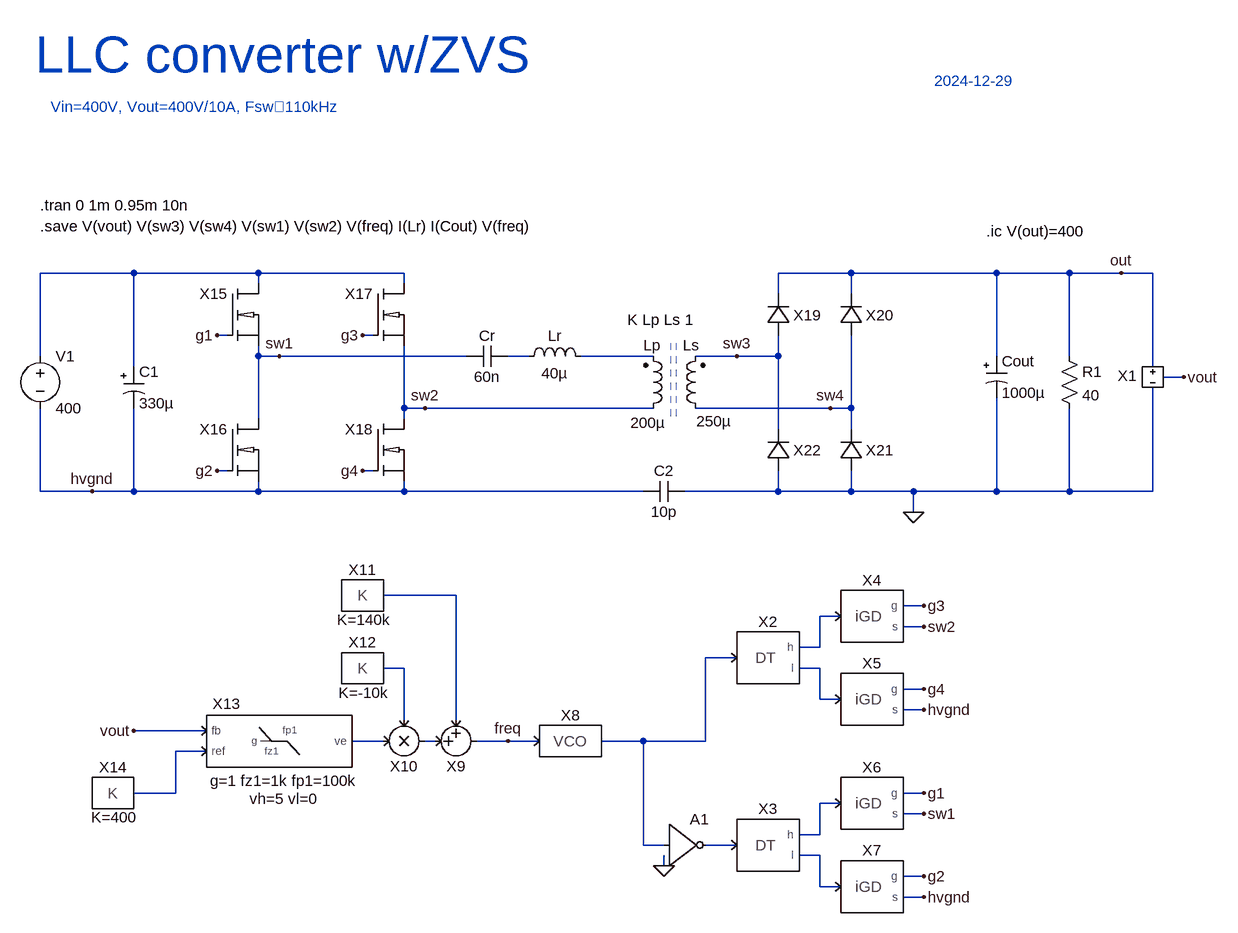
[diagram p0: schematic LLC.asc]
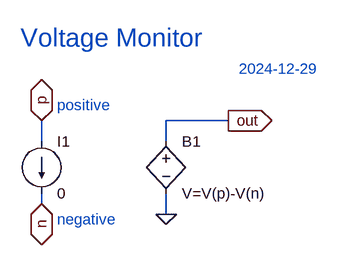
[diagram p1: sub-circuit vmon.asc]
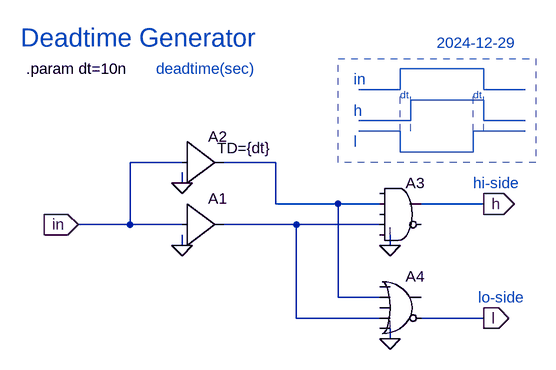
[diagram p2: sub-circuit deadtime.asc]
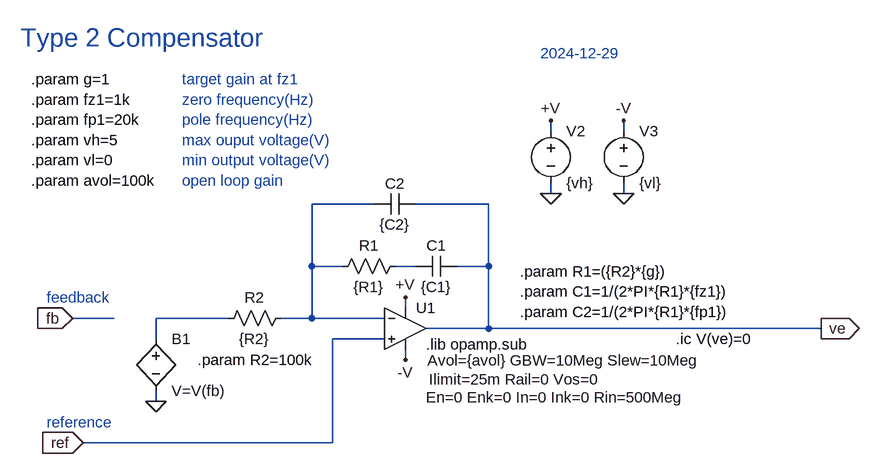
[diagram p3: sub-circuit type2.asc]
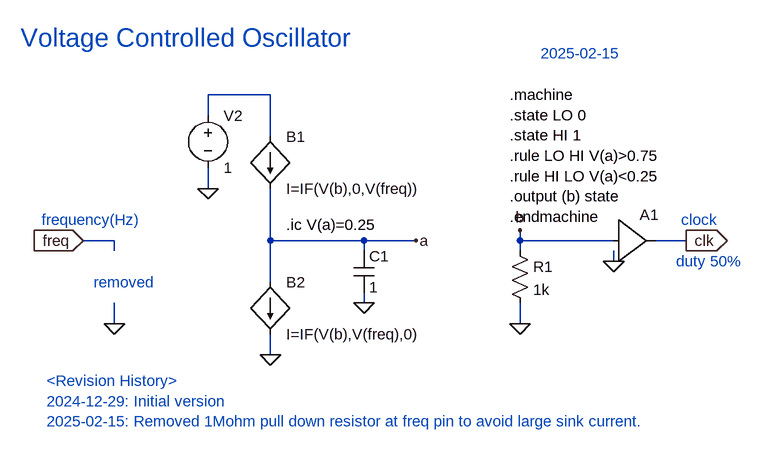
[diagram p4: sub-circuit vco.asc]
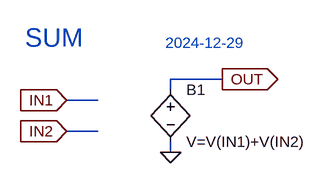
[diagram p5: sub-circuit sum.asc]
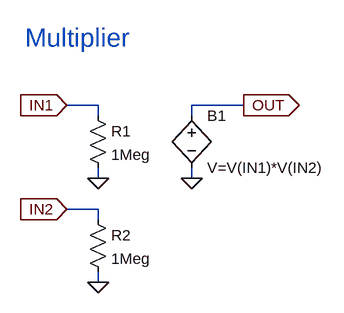
[diagram p6: sub-circuit mul.asc]
LLC.asc, the LTspice schematic file:
Version 4
SHEET 1 1968 1068
WIRE -80 -16 -224 -16
WIRE 112 -16 -80 -16
WIRE 336 -16 112 -16
WIRE 1024 -16 912 -16
WIRE 1248 -16 1024 -16
WIRE 1360 -16 1248 -16
WIRE 1440 -16 1360 -16
WIRE 1488 -16 1440 -16
WIRE 112 0 112 -16
WIRE 336 0 336 -16
WIRE 912 16 912 -16
WIRE 1024 16 1024 -16
WIRE 64 80 48 80
WIRE 288 80 272 80
WIRE -224 112 -224 -16
WIRE 112 112 112 96
WIRE 144 112 112 112
WIRE 432 112 144 112
WIRE 528 112 496 112
WIRE 720 112 608 112
WIRE 848 112 784 112
WIRE 912 112 912 80
WIRE 912 112 848 112
WIRE 1248 112 1248 -16
WIRE 1360 112 1360 -16
WIRE -80 128 -80 -16
WIRE 1488 128 1488 -16
WIRE 1536 144 1504 144
WIRE 336 192 336 96
WIRE 368 192 336 192
WIRE 720 192 368 192
WIRE 992 192 784 192
WIRE 1024 192 1024 80
WIRE 1024 192 992 192
WIRE 112 208 112 112
WIRE 336 208 336 192
WIRE 912 224 912 112
WIRE 1024 224 1024 192
WIRE 64 288 48 288
WIRE 288 288 272 288
WIRE -224 320 -224 192
WIRE -144 320 -224 320
WIRE -80 320 -80 192
WIRE -80 320 -144 320
WIRE 112 320 112 304
WIRE 112 320 -80 320
WIRE 336 320 336 304
WIRE 336 320 112 320
WIRE 704 320 336 320
WIRE 912 320 912 288
WIRE 912 320 768 320
WIRE 1024 320 1024 288
WIRE 1024 320 912 320
WIRE 1120 320 1024 320
WIRE 1248 320 1248 176
WIRE 1248 320 1120 320
WIRE 1360 320 1360 192
WIRE 1360 320 1248 320
WIRE 1488 320 1488 160
WIRE 1488 320 1360 320
WIRE 1120 352 1120 320
WIRE 416 480 304 480
WIRE 1136 496 1104 496
WIRE 1008 512 976 512
WIRE 1136 528 1104 528
WIRE 976 560 976 512
WIRE 976 560 944 560
WIRE 848 576 800 576
WIRE 336 592 304 592
WIRE 976 592 944 592
WIRE 1136 624 1104 624
WIRE 976 640 976 592
WIRE 1008 640 976 640
WIRE 1136 656 1104 656
WIRE 336 672 336 592
WIRE 416 672 416 480
WIRE 32 688 -80 688
WIRE 304 704 256 704
WIRE 384 704 368 704
WIRE 496 704 448 704
WIRE 544 704 496 704
WIRE 704 704 640 704
WIRE 800 704 800 576
WIRE 800 704 704 704
WIRE 32 720 -16 720
WIRE -16 784 -16 720
WIRE -16 784 -80 784
WIRE 1136 784 1104 784
WIRE 1008 800 976 800
WIRE 1136 816 1104 816
WIRE 976 848 976 800
WIRE 976 848 944 848
WIRE 704 864 704 704
WIRE 736 864 704 864
WIRE 848 864 800 864
WIRE 976 880 944 880
WIRE 736 896 736 880
WIRE 1136 912 1104 912
WIRE 976 928 976 880
WIRE 1008 928 976 928
WIRE 1136 944 1104 944
FLAG 48 80 g1
FLAG 48 288 g2
FLAG 144 112 sw1
FLAG 272 80 g3
FLAG 272 288 g4
FLAG 368 192 sw2
FLAG 1440 -16 out
FLAG 1536 144 vout
FLAG 1136 784 g1
FLAG 1136 816 sw1
FLAG 1136 912 g2
FLAG 1136 496 g3
FLAG 1136 528 sw2
FLAG 1136 624 g4
FLAG -80 688 vout
FLAG -144 320 hvgnd
FLAG 1136 656 hvgnd
FLAG 1136 944 hvgnd
FLAG 848 112 sw3
FLAG 992 192 sw4
FLAG 1120 352 0
FLAG 496 704 freq
FLAG 736 896 0
SYMBOL voltage -224 96 R0
WINDOW 123 0 0 Left 0
WINDOW 39 0 0 Left 0
SYMATTR InstName V1
SYMATTR Value 400
SYMBOL polcap -96 128 R0
WINDOW 3 24 56 Left 2
SYMATTR Value 330µ
SYMATTR InstName C1
SYMATTR Description Capacitor
SYMATTR Type cap
SYMATTR SpiceLine Irms=1.5 Rser=0.1
SYMBOL ind2 704 208 M180
WINDOW 0 0 113 Left 2
WINDOW 3 -20 -6 Left 2
SYMATTR InstName Lp
SYMATTR Value 200µ
SYMATTR SpiceLine Rser=10m
SYMBOL ind2 800 208 R180
WINDOW 0 9 113 Left 2
WINDOW 3 -40 -4 Left 2
SYMATTR InstName Ls
SYMATTR Value 250µ
SYMATTR SpiceLine Rser=10m
SYMBOL polcap 1232 112 R0
WINDOW 3 24 56 Left 2
SYMATTR Value 1000µ
SYMATTR InstName Cout
SYMATTR Description Capacitor
SYMATTR Type cap
SYMATTR SpiceLine Rser=10m
SYMBOL VMON 1488 144 R0
WINDOW 0 -24 -2 Right 2
SYMATTR InstName X1
SYMBOL DEADTIME 896 864 R0
SYMATTR InstName X3
SYMBOL DEADTIME 896 576 R0
SYMATTR InstName X2
SYMBOL res 1344 96 R0
SYMATTR InstName R1
SYMATTR Value 40
SYMBOL TYPE2 144 704 R0
WINDOW 0 -81 -57 Center 2
WINDOW 39 7 61 Center 2
WINDOW 40 7 89 Center 2
SYMATTR InstName X13
SYMBOL CONST -112 784 R0
WINDOW 39 2 53 Bottom 2
SYMATTR SpiceLine K=400
SYMATTR InstName X14
SYMBOL cap 496 96 R90
WINDOW 0 0 32 VBottom 2
WINDOW 3 32 32 VTop 2
SYMATTR InstName Cr
SYMATTR Value 60n
SYMBOL ind 512 128 R270
WINDOW 0 32 56 VTop 2
WINDOW 3 5 56 VBottom 2
SYMATTR InstName Lr
SYMATTR Value 40µ
SYMATTR SpiceLine Rser=1m
SYMBOL VCO 592 704 R0
SYMATTR InstName X8
SYMBOL Digital\\inv 736 800 R0
SYMATTR InstName A1
SYMBOL CONST 272 592 R0
WINDOW 39 2 53 Bottom 2
SYMATTR SpiceLine K=-10k
SYMATTR InstName X12
SYMBOL CONST 272 480 R0
WINDOW 39 2 53 Bottom 2
SYMATTR SpiceLine K=140k
SYMATTR InstName X11
SYMBOL iGD 1056 512 R0
SYMATTR InstName X4
SYMBOL iGD 1056 640 R0
SYMATTR InstName X5
SYMBOL iGD 1056 800 R0
SYMATTR InstName X6
SYMBOL iGD 1056 928 R0
SYMATTR InstName X7
SYMBOL SUM 416 704 M180
SYMATTR InstName X9
SYMBOL MUL 336 704 M180
SYMATTR InstName X10
SYMBOL iNMOS 112 48 R0
SYMATTR InstName X15
SYMBOL iNMOS 112 256 R0
SYMATTR InstName X16
SYMBOL iNMOS 336 48 R0
SYMATTR InstName X17
SYMBOL iNMOS 336 256 R0
SYMATTR InstName X18
SYMBOL iD 912 48 R180
SYMATTR InstName X19
SYMBOL iD 1024 48 R180
SYMATTR InstName X20
SYMBOL iD 1024 256 R180
SYMATTR InstName X21
SYMBOL iD 912 256 R180
SYMATTR InstName X22
SYMBOL cap 768 304 R90
WINDOW 0 0 32 VBottom 2
WINDOW 3 32 32 VTop 2
SYMATTR InstName C2
SYMATTR Value 10p
TEXT 680 56 Left 2 !K Lp Ls 1
TEXT -224 -120 Left 2 !.tran 0 1m 0.95m 10n
TEXT -232 -352 Left 6 ;LLC converter w/ZVS
TEXT 1232 -80 Left 2 !.ic V(out)=400
TEXT -224 -88 Left 2 !.save V(vout) V(sw3) V(sw4) V(sw1) V(sw2) V(freq) I(Lr) I(Cout) V(freq)
TEXT 1152 -312 Left 2 ;2024-12-29
TEXT -208 -272 Left 2 ;Vin=400V, Vout=400V/10A, Fsw≒110kHz
LINE Normal 747 204 747 92 1
LINE Normal 755 204 755 92 1

vmon.asc, the sub-circuit schematic file:
Version 4
SHEET 1 880 680
WIRE 176 -32 80 -32
WIRE -112 0 -112 -32
WIRE 80 0 80 -32
WIRE -112 96 -112 80
WIRE 80 112 80 80
FLAG -112 -32 p
IOPIN -112 -32 BiDir
FLAG -112 96 n
IOPIN -112 96 BiDir
FLAG 176 -32 out
IOPIN 176 -32 Out
FLAG 80 112 0
SYMBOL bv 80 -16 R0
SYMATTR InstName B1
SYMATTR Value V=V(p)-V(n)
SYMBOL current -112 0 R0
WINDOW 123 0 0 Left 0
WINDOW 39 0 0 Left 0
SYMATTR InstName I1
SYMATTR Value 0
TEXT -144 -160 Left 4 ;Voltage Monitor
TEXT -88 -56 Left 2 ;positive
TEXT -88 120 Left 2 ;negative
TEXT 192 -112 Left 2 ;2024-12-29

deadtime.asc, the sub-circuit schematic file:
Version 4
SHEET 1 1412 1312
WIRE 64 288 -16 288
WIRE 208 288 128 288
WIRE 64 320 64 304
WIRE 208 352 208 288
WIRE 304 352 208 352
WIRE 368 352 304 352
WIRE 528 352 432 352
WIRE -16 384 -16 288
WIRE -16 384 -96 384
WIRE 64 384 -16 384
WIRE 240 384 128 384
WIRE 368 384 240 384
WIRE 64 416 64 400
WIRE 384 416 384 400
WIRE 304 496 304 352
WIRE 368 496 304 496
WIRE 240 528 240 384
WIRE 368 528 240 528
WIRE 528 528 432 528
WIRE 384 560 384 544
FLAG -96 384 in
IOPIN -96 384 In
FLAG 64 416 0
FLAG 64 320 0
FLAG 384 416 0
FLAG 384 560 0
FLAG 528 352 h
IOPIN 528 352 Out
FLAG 528 528 l
IOPIN 528 528 Out
SYMBOL Digital\\buf1 64 320 R0
SYMATTR InstName A1
SYMBOL Digital\\buf1 64 224 R0
WINDOW 3 54 42 Left 2
SYMATTR Value TD={dt}
SYMATTR InstName A2
SYMBOL Digital\\and 400 304 R0
SYMATTR InstName A3
SYMBOL Digital\\or 400 448 R0
SYMATTR InstName A4
TEXT -176 144 Left 2 !.param dt=10n
TEXT -184 96 Left 4 ;Deadtime Generator
TEXT 24 144 Left 2 ;deadtime(sec)
TEXT 512 320 Left 2 ;hi-side
TEXT 520 496 Left 2 ;lo-side
TEXT 328 160 Left 2 ;in
TEXT 328 208 Left 2 ;h
TEXT 328 256 Left 2 ;l
TEXT 400 184 Left 1 ;dt
TEXT 512 184 Left 1 ;dt
TEXT 456 104 Left 2 ;2024-12-29
LINE Normal 400 176 336 176
LINE Normal 400 176 400 144
LINE Normal 528 144 400 144
LINE Normal 528 176 528 144
LINE Normal 592 176 528 176
LINE Normal 416 224 336 224
LINE Normal 416 224 416 192
LINE Normal 528 192 416 192
LINE Normal 528 224 528 192
LINE Normal 592 224 528 224
LINE Normal 400 240 336 240
LINE Normal 400 272 400 240
LINE Normal 512 272 400 272
LINE Normal 512 272 512 240
LINE Normal 592 240 512 240
LINE Normal 400 240 400 176 2
LINE Normal 512 240 512 176 2
LINE Normal 416 240 416 176 2
LINE Normal 528 240 528 176 2
RECTANGLE Normal 608 288 304 128 2

type2.asc, the sub-circuit schematic file:
Version 4
SHEET 1 1008 680
WIRE 464 -144 464 -160
WIRE 576 -144 576 -160
WIRE 464 -48 464 -64
WIRE 576 -48 576 -64
WIRE 192 -32 96 -32
WIRE 368 -32 256 -32
WIRE 96 64 96 -32
WIRE 144 64 96 64
WIRE 256 64 224 64
WIRE 368 64 368 -32
WIRE 368 64 320 64
WIRE 240 128 240 112
WIRE -208 144 -272 144
WIRE -32 144 -144 144
WIRE 96 144 96 64
WIRE 96 144 48 144
WIRE 208 144 96 144
WIRE 368 160 368 64
WIRE 368 160 272 160
WIRE 880 160 368 160
WIRE -144 176 -144 144
WIRE 208 176 128 176
WIRE 240 208 240 192
WIRE -144 272 -144 256
WIRE 128 336 128 176
WIRE 128 336 -256 336
FLAG -272 144 fb
IOPIN -272 144 In
FLAG -256 336 ref
IOPIN -256 336 In
FLAG -144 272 0
FLAG 880 160 ve
IOPIN 880 160 Out
FLAG 576 -48 0
FLAG 464 -48 0
FLAG 464 -160 +V
FLAG 576 -160 -V
FLAG 240 112 +V
FLAG 240 208 -V
SYMBOL res 240 48 R90
WINDOW 0 0 56 VBottom 2
WINDOW 3 32 56 VTop 2
SYMATTR InstName R1
SYMATTR Value {R1}
SYMBOL cap 320 48 R90
WINDOW 0 0 32 VBottom 2
WINDOW 3 32 32 VTop 2
SYMATTR InstName C1
SYMATTR Value {C1}
SYMBOL cap 256 -48 R90
WINDOW 0 0 32 VBottom 2
WINDOW 3 32 32 VTop 2
SYMATTR InstName C2
SYMATTR Value {C2}
SYMBOL bv -144 160 R0
SYMATTR InstName B1
SYMATTR Value V=V(fb)
SYMBOL res 64 128 R90
WINDOW 0 0 56 VBottom 2
WINDOW 3 32 56 VTop 2
SYMATTR InstName R2
SYMATTR Value {R2}
SYMBOL UniversalOpAmp2 240 160 R0
WINDOW 123 34 49 Left 2
WINDOW 39 36 78 Left 2
WINDOW 40 32 106 Left 2
SYMATTR Value2 Avol={avol} GBW=10Meg Slew=10Meg
SYMATTR InstName U1
SYMBOL voltage 464 -160 R0
SYMATTR InstName V2
SYMATTR Value {vh}
SYMBOL voltage 576 -160 R0
SYMATTR InstName V3
SYMATTR Value {vl}
TEXT 272 184 Left 2 !.lib opamp.sub
TEXT -336 -224 Left 2 !.param g=1\n.param fz1=1k\n.param fp1=20k\n.param vh=5\n.param vl=0\n.param avol=100k
TEXT 416 72 Left 2 !.param R1=({R2}*{g})\n.param C1=1/(2*PI*{R1}*{fz1})\n.param C2=1/(2*PI*{R1}*{fp1})
TEXT -352 -288 Left 4 ;Type 2 Compensator
TEXT -80 208 Left 2 !.param R2=100k
TEXT -104 -224 Left 2 ;target gain at fz1\nzero frequency(Hz)\npole frequency(Hz)\nmax ouput voltage(V)\nmin output voltage(V)\nopen loop gain
TEXT -312 112 Left 2 ;feedback
TEXT -312 304 Left 2 ;reference
TEXT 656 176 Left 2 !.ic V(ve)=0
TEXT 448 -264 Left 2 ;2024-12-29

vco.asc, the sub-circuit schematic file:
Version 4
SHEET 1 1132 680
WIRE 176 -176 80 -176
WIRE 80 -144 80 -176
WIRE 176 -112 176 -176
WIRE 80 -32 80 -64
WIRE -64 48 -112 48
WIRE 176 48 176 -32
WIRE 320 48 176 48
WIRE 400 48 320 48
WIRE 560 48 560 32
WIRE 704 48 560 48
WIRE 816 48 768 48
WIRE -64 64 -64 48
WIRE 320 64 320 48
WIRE 560 64 560 48
WIRE 704 80 704 64
WIRE 176 112 176 48
WIRE 320 144 320 128
WIRE -64 176 -64 144
WIRE 560 176 560 144
WIRE 176 224 176 192
FLAG 320 144 0
FLAG 560 176 0
FLAG 176 224 0
FLAG 80 -32 0
FLAG 400 48 a
FLAG 560 32 b
FLAG 704 80 0
FLAG 816 48 clk
IOPIN 816 48 Out
FLAG -112 48 freq
IOPIN -112 48 In
FLAG -64 176 0
SYMBOL cap 304 64 R0
SYMATTR InstName C1
SYMATTR Value 1
SYMBOL res 544 48 R0
SYMATTR InstName R1
SYMATTR Value 1k
SYMBOL voltage 80 -160 R0
WINDOW 123 0 0 Left 0
WINDOW 39 0 0 Left 0
SYMATTR InstName V2
SYMATTR Value 1
SYMBOL bi 176 112 R0
SYMATTR InstName B2
SYMATTR Value I=IF(V(b),V(freq),0)
SYMBOL bi 176 -112 R0
SYMATTR InstName B1
SYMATTR Value I=IF(V(b),0,V(freq))
SYMBOL Digital\\buf1 704 -16 R0
SYMATTR InstName A1
TEXT 544 -176 Left 2 !.machine\n.state LO 0\n.state HI 1\n.rule LO HI V(a)>0.75\n.rule HI LO V(a)<0.25\n.output (b) state\n.endmachine
TEXT 200 24 Left 2 !.ic V(a)=0.25
TEXT -208 -264 Left 4 ;Voltage Controlled Oscillator
TEXT -176 16 Left 2 ;frequency(Hz)
TEXT 808 16 Left 2 ;clock
TEXT 800 80 Left 2 ;duty 50%
TEXT 592 -240 Left 2 ;2025-02-15
TEXT -168 264 Left 2 ;<Revision History>\n2024-12-29: Initial version\n2025-02-15: Removed 1Mohm pull down resistor at freq pin to avoid large sink current.
TEXT -96 112 Left 2 ;removed

sum.asc, the sub-circuit schematic file:
Version 4
SHEET 1 880 680
WIRE 288 96 208 96
WIRE 208 112 208 96
WIRE 96 128 48 128
WIRE 96 176 48 176
WIRE 208 208 208 192
FLAG 48 128 IN1
IOPIN 48 128 In
FLAG 48 176 IN2
IOPIN 48 176 In
FLAG 208 208 0
FLAG 288 96 OUT
IOPIN 288 96 Out
SYMBOL bv 208 96 R0
SYMATTR InstName B1
SYMATTR Value V=V(IN1)+V(IN2)
TEXT -16 32 Left 4 ;SUM
TEXT 200 40 Left 2 ;2024-12-29

mul.asc, the sub-circuit schematic file:
Version 4
SHEET 1 880 680
WIRE 96 48 48 48
WIRE 320 48 240 48
WIRE 96 64 96 48
WIRE 240 64 240 48
WIRE 96 160 96 144
WIRE 240 160 240 144
WIRE 96 208 48 208
WIRE 96 224 96 208
WIRE 96 320 96 304
FLAG 48 48 IN1
IOPIN 48 48 In
FLAG 48 208 IN2
IOPIN 48 208 In
FLAG 240 160 0
FLAG 320 48 OUT
IOPIN 320 48 Out
FLAG 96 160 0
FLAG 96 320 0
SYMBOL bv 240 48 R0
SYMATTR InstName B1
SYMATTR Value V=V(IN1)*V(IN2)
SYMBOL res 80 48 R0
SYMATTR InstName R1
SYMATTR Value 1Meg
SYMBOL res 80 208 R0
SYMATTR InstName R2
SYMATTR Value 1Meg
TEXT -16 -56 Left 4 ;Multiplier

The netlist it stands for:
* LLC.asc
V1 N001 hvgnd 400
C1 N001 hvgnd 330µ Irms=1.5 Rser=0.1
Lp sw2 N003 200µ Rser=10m
Ls sw4 sw3 250µ Rser=10m
Cout out 0 1000µ Rser=10m
XX1 0 vout out vmon
XX3 N013 N014 N012 deadtime params: dt=10n
XX2 N006 N008 N005 deadtime params: dt=10n
R1 out 0 40
XX13 vout N011 N009 type2 params: avol=100k g=1 fz1=1k fp1=100k vh=5 vl=0
XX14 N011 CONST K=400  ; pins K
Cr N002 sw1 60n
Lr N002 N003 40µ Rser=1m
XX8 freq N006 vco
A1 N006 0 0 0 0 N013 0 0 BUF
XX12 N007 CONST K=-10k  ; pins K
XX11 N004 CONST K=140k  ; pins K
XX4 N005 g3 sw2 iGD  ; pins in g s
XX5 N008 g4 hvgnd iGD  ; pins in g s
XX6 N012 g1 sw1 iGD  ; pins in g s
XX7 N014 g2 hvgnd iGD  ; pins in g s
XX9 N010 N004 freq sum
XX10 N009 N007 N010 mul
XX15 N001 g1 sw1 iNMOS params: esl=1f rsnb=1k csnb=10p ron=10m  ; pins D G S
XX16 sw1 g2 hvgnd iNMOS params: esl=1f rsnb=1k csnb=10p ron=10m  ; pins D G S
XX17 N001 g3 sw2 iNMOS params: esl=1f rsnb=1k csnb=10p ron=10m  ; pins D G S
XX18 sw2 g4 hvgnd iNMOS params: esl=1f rsnb=1k csnb=10p ron=10m  ; pins D G S
XX19 sw3 out iD params: von=1n ron=10m esl=1f rsnb=1k csnb=10p  ; pins AN CA
XX20 sw4 out iD params: von=1n ron=10m esl=1f rsnb=1k csnb=10p  ; pins AN CA
XX21 0 sw4 iD params: von=1n ron=10m esl=1f rsnb=1k csnb=10p  ; pins AN CA
XX22 0 sw3 iD params: von=1n ron=10m esl=1f rsnb=1k csnb=10p  ; pins AN CA
C2 0 hvgnd 10p

* block symbol definitions
.subckt vmon n out p
B1 out 0 V=V(p)-V(n)
I1 p n 0
* Voltage Monitor
* positive
* negative
* 2024-12-29
.ends vmon

.subckt deadtime in l h
A1 in 0 0 0 0 0 N002 0 BUF
A2 in 0 0 0 0 0 N001 0 BUF TD={dt}
A3 0 N001 0 N002 0 0 h 0 AND
A4 0 N001 0 N002 0 l 0 0 OR
.param dt=10n
* Deadtime Generator
* deadtime(sec)
* hi-side
* lo-side
* in
* h
* l
* dt
* dt
* 2024-12-29
.ends deadtime

.subckt type2 fb ref ve
R1 N002 N001 {R1}
C1 ve N002 {C1}
C2 ve N001 {C2}
B1 N003 0 V=V(fb)
R2 N001 N003 {R2}
XU1 ref N001 +V -V ve level2 Avol={avol} GBW=10Meg Slew=10Meg Ilimit=25m Rail=0 Vos=0 En=0 Enk=0 In=0 Ink=0 Rin=500Meg  ; pins In+ In- V+ V- OUT
V2 +V 0 {vh}
V3 -V 0 {vl}
.lib opamp.sub
.param g=1
.param fz1=1k
.param fp1=20k
.param vh=5
.param vl=0
.param avol=100k
.param R1=({R2}*{g})
.param C1=1/(2*PI*{R1}*{fz1})
.param C2=1/(2*PI*{R1}*{fp1})
* Type 2 Compensator
.param R2=100k
* target gain at fz1
* zero frequency(Hz)
* pole frequency(Hz)
* max ouput voltage(V)
* min output voltage(V)
* open loop gain
* feedback
* reference
.ic V(ve)=0
* 2024-12-29
.ends type2

.subckt vco freq clk
C1 a 0 1
R1 b 0 1k
V2 N001 0 1
B2 a 0 I=IF(V(b),V(freq),0)
B1 N001 a I=IF(V(b),0,V(freq))
A1 b 0 0 0 0 0 clk 0 BUF
.machine
.state LO 0
.state HI 1
.rule LO HI V(a)>0.75
.rule HI LO V(a)<0.25
.output (b) state
.endmachine
.ic V(a)=0.25
* Voltage Controlled Oscillator
* frequency(Hz)
* clock
* duty 50%
* 2025-02-15
* <Revision History>
* 2024-12-29: Initial version
* 2025-02-15: Removed 1Mohm pull down resistor at freq pin to avoid large sink current.
* removed
.ends vco

.subckt sum in1 in2 out
B1 OUT 0 V=V(IN1)+V(IN2)
* SUM
* 2024-12-29
.ends sum

.subckt mul in1 in2 out
B1 OUT 0 V=V(IN1)*V(IN2)
R1 IN1 0 1Meg
R2 IN2 0 1Meg
* Multiplier
.ends mul

K Lp Ls 1
.tran 0 1m 0.95m 10n
* LLC converter w/ZVS
.ic V(out)=400
.save V(vout) V(sw3) V(sw4) V(sw1) V(sw2) V(freq) I(Lr) I(Cout) V(freq)
* 2024-12-29
* Vin=400V, Vout=400V/10A, Fsw≒110kHz
.lib UniversalOpAmp2.lib
.backanno
.end